# Altium project Mppt_Project.PrjPCB
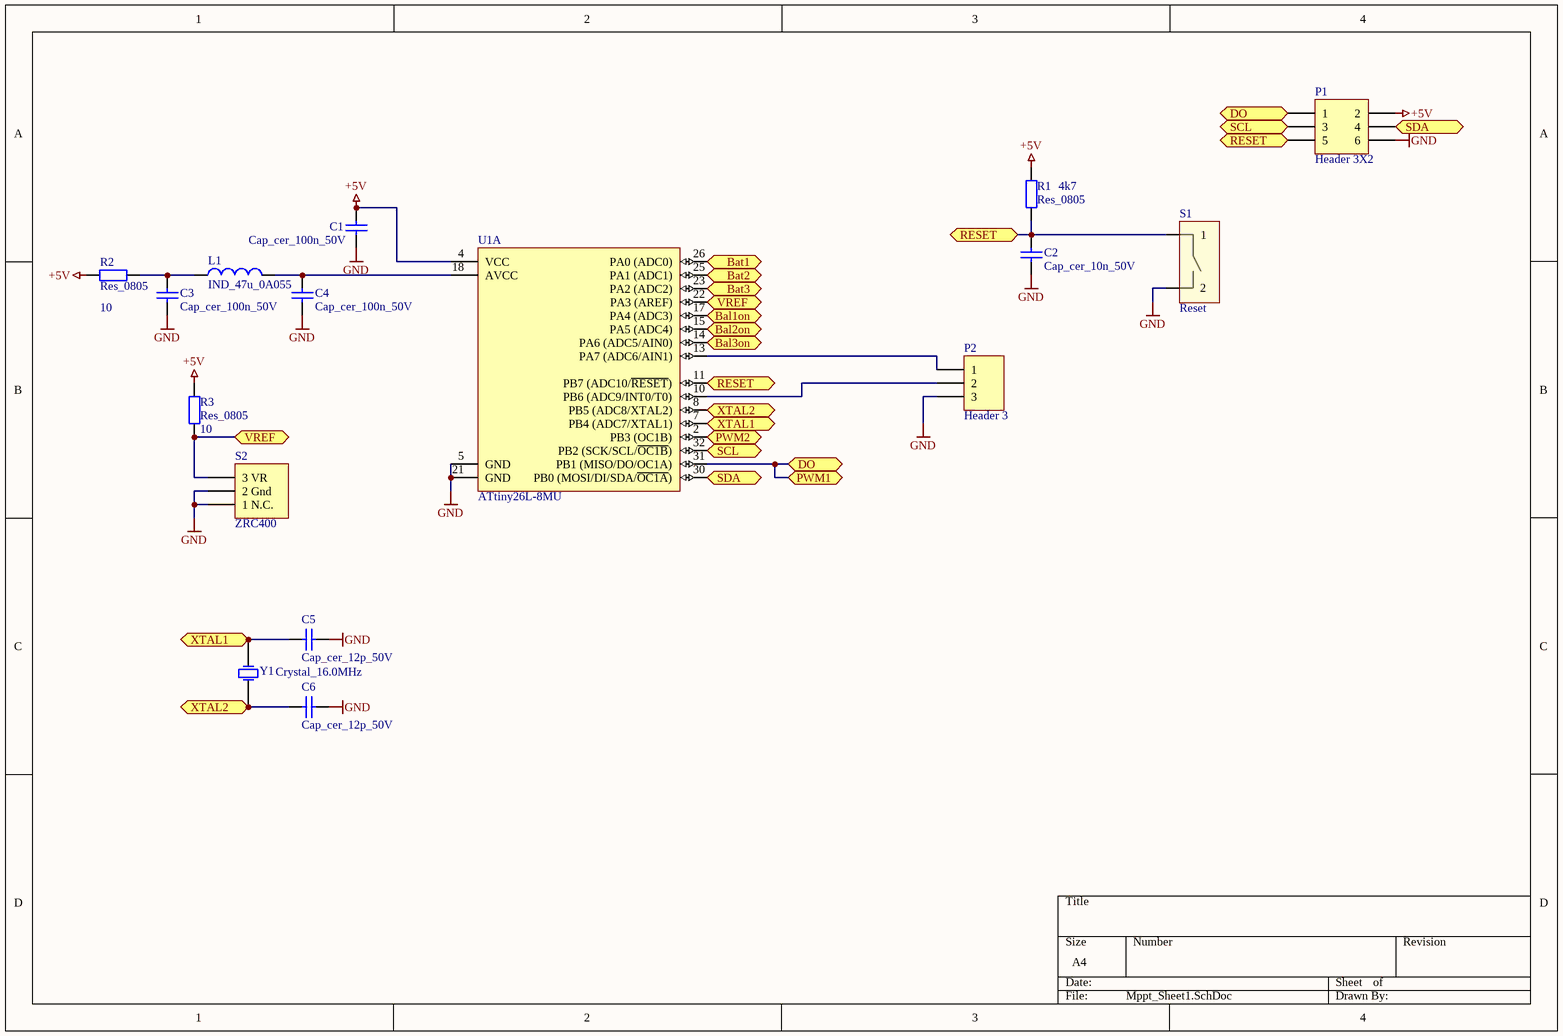
[diagram p0: Mppt_Sheet1.SchDoc]
5 sheets, 89 parts. Net scope: flat (ports and power ports of the same name join across sheets).
Board files: Mppt_PCB1.PcbDoc, Mppt_PCB2.PcbDoc, Mppt_PCB_seb.PcbDoc
Sheets:
  Mppt_Sheet1.SchDoc
  Boost.SchDoc
  Buck.SchDoc
  CurrentSensor.SchDoc
  Balancer.SchDoc

## Sheet Mppt_Sheet1.SchDoc
size A4

### Parts
C1  Cap_cer_100n_50V  [_0805]
C2  Cap_cer_10n_50V  [_0805]
C3  Cap_cer_100n_50V  [_0805]
C4  Cap_cer_100n_50V  [_0805]
C5  Cap_cer_12p_50V  [_0805]
C6  Cap_cer_12p_50V  [_0805]
L1  IND_47u_0A055  [COIL_0805]
P1  Header 3X2  [HDR2X3]
P2  Header 3  [HDR1X3]
R1  Res_0805  value 4k7  [_0805]
R2  Res_0805  value 10  [_0805]
R3  Res_0805  value 10  [_0805]
S1  Reset  [SWITCH_SMD]
S2  ZRC400  [SOT23_N]
U1  ATtiny26L-8MU  [32M1-A_N]  (part A of 2)
Y1  Crystal_16.0MHz  [XTAL_SMD]

### Ports
Bal1on, Bal2on, Bal3on, Bat1, Bat2, Bat3, DO, PWM1, PWM2, RESET, SCL, SDA, VREF, XTAL1, XTAL2

### Nets
+5V: C1.2 P1.2 R1.1 R2.1 R3.2 U1.4(VCC)
GND: C1.1 C2.2 C3.1 C4.1 C5.2 C6.2 P1.6 P2.3 S1.2 S2.1(1_N.C.) S2.2(2_Gnd) U1.5(GND) U1.21(GND)
NetC2_1: C2.1 P1.5 R1.2 S1.1 U1.11(PB7_(ADC10/~{RESET})) ; port RESET
NetC3_2: C3.2 L1.1 R2.2
NetC4_2: C4.2 L1.2 U1.18(AVCC)
NetC5_1: C5.1 U1.7(PB4_(ADC7/XTAL1)) Y1.2(OSC2) ; port XTAL1
NetC6_1: C6.1 U1.8(PB5_(ADC8/XTAL2)) Y1.1(OSC1) ; port XTAL2
NetP1_1: P1.1 U1.31(PB1_(MISO/DO/OC1A)) ; port DO, port PWM1
NetP1_3: P1.3 U1.32(PB2_(SCK/SCL/~{OC1B})) ; port SCL
NetP1_4: P1.4 U1.30(PB0_(MOSI/DI/SDA/~{OC1A})) ; port SDA
NetP2_1: P2.1 U1.13(PA7_(ADC6/AIN1))
NetP2_2: P2.2 U1.10(PB6_(ADC9/INT0/T0))
NetQ43_1: U1.14(PA6_(ADC5/AIN0)) ; port Bal3on
NetR3_1: R3.1 S2.3(3_VR) U1.22(PA3_(AREF)) ; port VREF
NetR44_1: U1.26(PA0_(ADC0)) ; port Bat1
NetR51_1: U1.25(PA1_(ADC1)) ; port Bat2
NetR58_1: U1.23(PA2_(ADC2)) ; port Bat3
NetU1_2: U1.2(PB3_(OC1B)) ; port PWM2
NetU1_15: U1.15(PA5_(ADC4)) ; port Bal2on
NetU1_17: U1.17(PA4_(ADC3)) ; port Bal1on

### Library data of the parts
C1 C3 C4 = Cap_124: QR: 0; Capacity: 100n; Voltage: 50V; UID: Cap_124; Name: Cap_cer_100n_50V; ComponentLink1URL: #NAME?; mounting: SMD
C2 = Cap_120: QR: 0; Capacity: 10n; Voltage: 50V; UID: Cap_120; Name: Cap_cer_10n_50V; ComponentLink1URL: #NAME?; mounting: SMD
C5 C6 = Cap_109: RS_number: 723-6206; QR: 0; Capacity: 12p; Voltage: 50V; UID: Cap_109; Name: Cap_cer_12p_50V; Name_Hyperlink: Keramikkondensator SMT 12 pF 50 VDC; ComponentLink1URL: #NAME?; mounting: SMD
L1 = Ind_41: Inductor; RS_number: 469-2883; QR: 0; Inductivity: 47 uH; Current: 0A055; UID: Ind_41; Name: IND_47u_0A055; Name_Hyperlink: http://at.rs-online.com/web/p/drahtgewickelte-smd-induktivitaten/4692883/?searchTerm=4692883&relevancy-data=636F3D3126696E3D4931384E525353746F636B4E756D6265724D504E266C753D656E266D6D3D6D61746368616C6C26706D3D5E5C647B367D247C5E5C647B377D247C5E5C647B31307D2; ComponentLink1URL: #NAME?; mounting: SMD
P1 = Con_41: QR: 0; UID: Con_41; Name: Header 3X2; mounting: THT; Pins: 2X3
P2 = Con_32: QR: 0; UID: Con_32; Name: Header 3; mounting: THT; Pins: 1X3
R1-R3 = Res_6: UID: Res_6; Name: Res_0805; ComponentLink1URL: #NAME?; mounting: SMD
S1 = Misc_11: QR: 0; UID: Misc_11; Name: Reset; ComponentLink1URL: #NAME?; mounting: SMD
S2 = Misc_1: 4,096V Voltage Regulator; QR: 0; UID: ZRC400; Name: ZRC400; ComponentLink1URL: http://at.rs-online.com/web/p/referenzspannungs-ics/7385115/; mounting: THT
U1 = ATtiny26L-8MU: 8-bit AVR Microcontroller, 2.7-5.5V, 8MHz, 2KB Flash, 128 Bytes EEPROM, 128 Bytes SRAM, 32-pin MLF, Industrial Grade (-40°C to 85°C), Pb-Free; DatasheetVersion: revK, Aug-2010; PackageVersion: revE, May-2006; PackageReference: 32M1-A; PackageDescription: 32-Pin Micro Lead Frame Package (MLF),  5 x 5 x 1.0 mm Body, Pitch 0.50 mm, 3.10mm Exposed Pad; Code_JEDEC: MO-220-VHHD-2; ComponentLink1Description: Manufacturer URL; ComponentLink1URL: http://www.atmel.com/; ComponentLink2Description: ATtiny26(L) Datasheet; ComponentLink2URL: http://www.atmel.com/dyn/resources/prod_documents/doc1477.pdf; ComponentLink3Description: ATtiny26(L) Summary; ComponentLink3URL: http://www.atmel.com/dyn/resources/prod_documents/1477S.pdf
Y1 = Crystal_19: RS_number: 703-1957; QR: 1; UID: Crystal_19; Name: Crystal_16.0MHz; Frequency: 16.0 MHz; Name_Hyperlink: Crystal, ABM7, 16.000MHz, SMD; ComponentLink1URL: #NAME?; mounting: SMD

## Sheet Boost.SchDoc
size A4
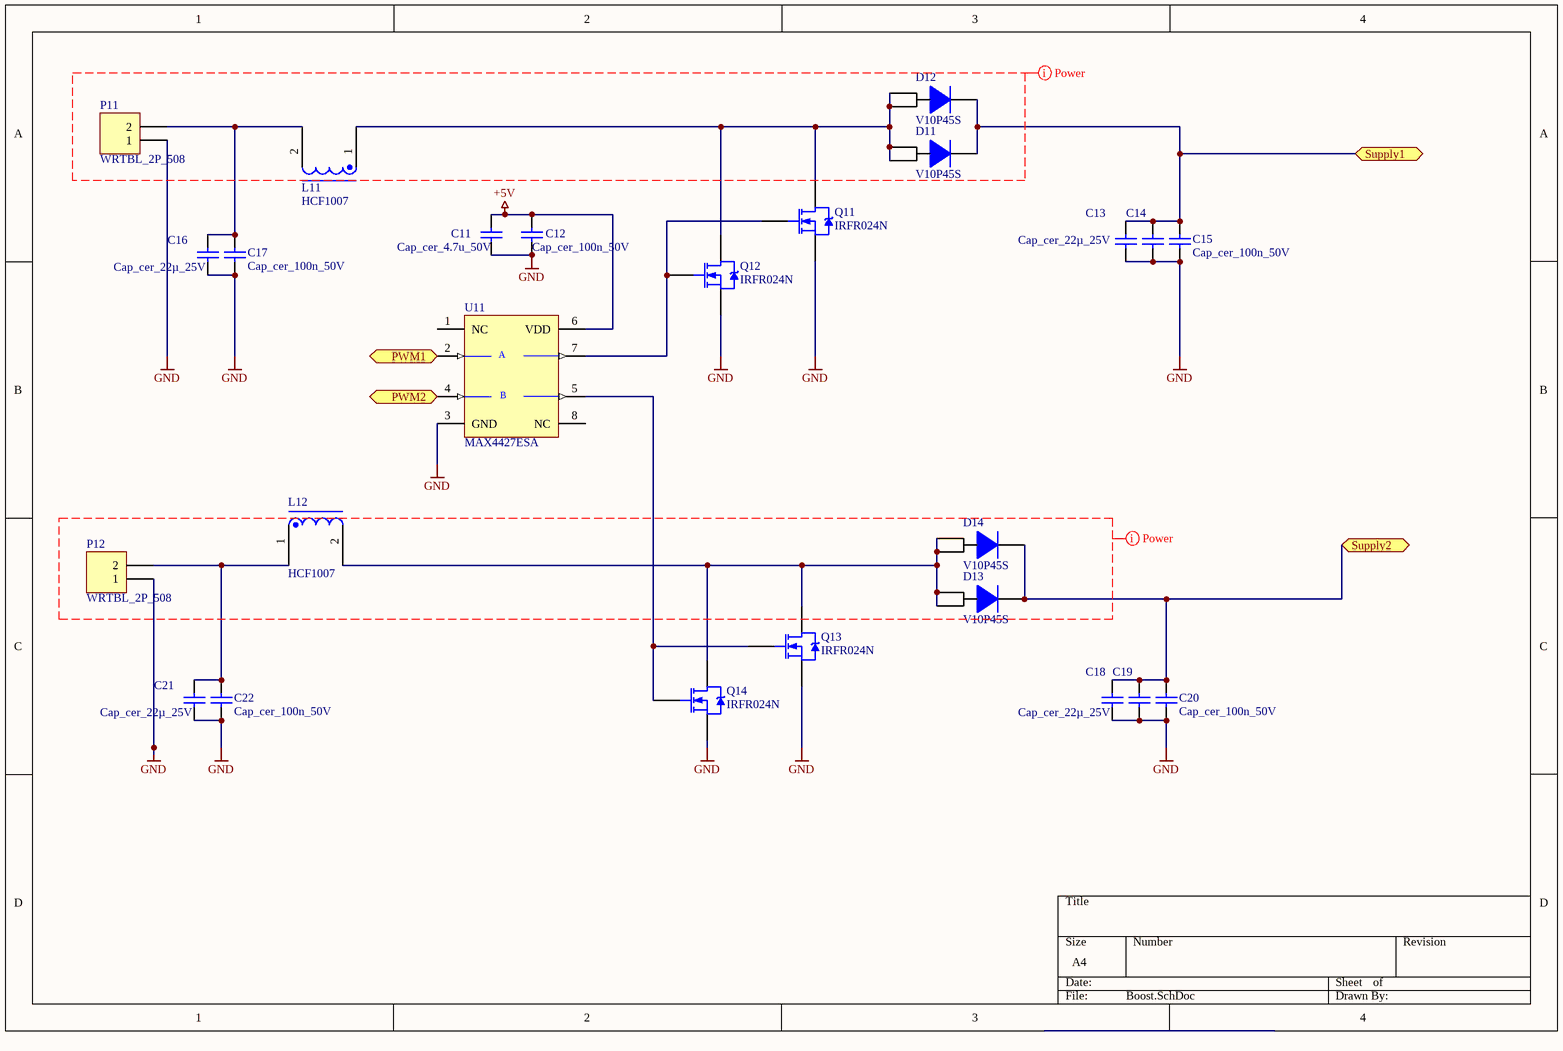
[diagram p1: Boost.SchDoc]

### Parts
C11  Cap_cer_4.7u_50V  [_0805]
C12  Cap_cer_100n_50V  [_0805]
C13  (no value)  [_0805]
C14  Cap_cer_22µ_25V  [_0805]
C15  Cap_cer_100n_50V  [_0805]
C16  Cap_cer_22µ_25V  [_0805]
C17  Cap_cer_100n_50V  [_0805]
C18  Cap_cer_22µ_25V  [_0805]  (value not drawn)
C19  Cap_cer_22µ_25V  [_0805]
C20  Cap_cer_100n_50V  [_0805]
C21  Cap_cer_22µ_25V  [_0805]
C22  Cap_cer_100n_50V  [_0805]
D11  V10P45S  [TO-277A]
D12  V10P45S  [TO-277A]
D13  V10P45S  [TO-277A]
D14  V10P45S  [TO-277A]
L11  HCF1007  [HCF1007]
L12  HCF1007  [HCF1007]
P11  WRTBL_2P_508  [WRTBL_2P_508]
P12  WRTBL_2P_508  [WRTBL_2P_508]
Q11  IRFR024N  [TO-252AA_N]
Q12  IRFR024N  [TO-252AA_N]
Q13  IRFR024N  [TO-252AA_N]
Q14  IRFR024N  [TO-252AA_N]
U11  MAX4427ESA  [NSO8_N]

### Ports
PWM1, PWM2, Supply1, Supply2

### Nets
+5V: C11.2 C12.2 U11.6(VDD)
GND: C11.1 C12.1 C13.1 C14.1 C15.1 C16.1 C17.1 C18.1 C19.1 C20.1 C21.1 C22.1 P11.1 P12.1 Q11.3(S) Q12.3(S) Q13.3(S) Q14.3(S) U11.3(GND)
NetC13_2: C13.2 C14.2 C15.2 D11.K D12.K ; port Supply1
NetC16_2: C16.2 C17.2 L11.2 P11.2
NetC18_2: C18.2 C19.2 C20.2 D13.K D14.K ; port Supply2
NetC21_2: C21.2 C22.2 L12.1 P12.2
NetD11_A1: D11.A1 D11.A2 D12.A1 D12.A2 L11.1 Q11.4(D) Q12.4(D)
NetD13_A1: D13.A1 D13.A2 D14.A1 D14.A2 L12.2 Q13.4(D) Q14.4(D)
NetP1_1: U11.2(INA) ; port PWM1
NetQ11_1: Q11.1(G) Q12.1(G) U11.7(OUTA)
NetQ13_1: Q13.1(G) Q14.1(G) U11.5(OUTB)
NetU1_2: U11.4(INB) ; port PWM2

Not connected (* = marked no-connect by the designer): U11 1(NC) 8(NC)

### Layout directives
net class Power: (no net found under the mark)

### Notes on the sheet
- (in symbol MAX4427ESA) A; B

### Library data of the parts
C11 C12 = Cap_124: QR: 0; Capacity: 4.7u; Voltage: 50V; UID: Cap_124; ComponentLink1URL: #NAME?; mounting: SMD
  C11: Name: Cap_cer_4.7u_50V
  C12: Name: Cap_cer_100n_50V
C13 = Cap_124: Name: Cap_cer_22µ_25V; QR: 0; Capacity: 22µ; Voltage: 25V; UID: Cap_124; ComponentLink1URL: http://at.rs-online.com/web/p/keramik-multilayer-kondensatoren/7900682/; mounting: SMD
C14 C16 C18 C19 C21 = Cap_124: QR: 0; Capacity: 22µ; Voltage: 25V; UID: Cap_124; Name: Cap_cer_22µ_25V; ComponentLink1URL: http://at.rs-online.com/web/p/keramik-multilayer-kondensatoren/7900682/; mounting: SMD
C15 C17 C20 C22 = Cap_124: QR: 0; Capacity: 100n; Voltage: 50V; UID: Cap_124; Name: Cap_cer_100n_50V; ComponentLink1URL: #NAME?; mounting: SMD
D11-D14 = V10P45S: V01P45 Shottky Diode; pin to pad: A1>1 A2>2
L11 L12 = HCF1007: HCF1007 Inductor
P11 P12 = Con_7: RS_number: 193-0586; QR: 0; UID: Con_7; Name: WRTBL_2P_508; Name_Hyperlink: Printklemme 5,08mm 2-polig; ComponentLink1URL: #NAME?; mounting: THT; Pins: 2
Q11-Q14 = IRFR024N: HEXFET N-Channel Power MOSFET; Note: Pin 2 is trimmed and is electrically connected to Drain.; Published: 8-Jun-2000; LatestRevisionDate: 20-Nov-2009; LatestRevisionNote: IPC-7351 Footprint Added.; DatasheetVersion: Apr-1998; PackageVersion: Feb-2003; PackageReference: TO-252AA; Publisher: Altium Limited; PackageDescription: 3-Pin HEXFET Package 2.28 mm Pitch, 9.9 mm Lead Span; Code_JEDEC: TO-252-AA; ComponentLink1Description: Manufacturer Link; ComponentLink1URL: http://www.irf.com/
U11 = MAX4427ESA: Dual High-Speed 1.5A MOSFET Driver; Published: 16-Jan-2001; LatestRevisionDate: 13-Apr-2006; LatestRevisionNote: IPC-7351 Footprint Added.; DatasheetVersion: Mar-1993; PackageReference: NSO8; Publisher: Altium Limited; PackageDescription: 8-Pin Small Outline Integrated Circuit 1.27 mm Pitch; Code_JEDEC: MS-012-AA; Code_IPC: SOIC127P600-8; ComponentLink1Description: Manufacturer Link; ComponentLink1URL: http://www.maxim-ic.com/; ComponentLink2Description: Datasheet; ComponentLink2URL: http://pdfserv.maxim-ic.com/en/ds/MAX4426-MAX4428.pdf

## Sheet Buck.SchDoc
size A4
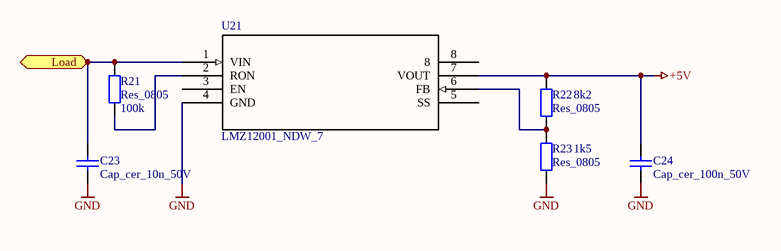
[diagram p2: Buck.SchDoc]

### Parts
C23  Cap_cer_10n_50V  [_0805]
C24  Cap_cer_100n_50V  [_0805]
R21  Res_0805  value 100k  [_0805]
R22  Res_0805  value 8k2  [_0805]
R23  Res_0805  value 1k5  [_0805]
U21  LMZ12001_NDW_7  [TZA07A]

### Ports
Load

### Nets
+5V: C24.2 R22.1 U21.7(VOUT)
GND: C23.2 C24.1 R23.2 U21.4(GND)
NetC23_1: C23.1 R21.2 U21.1(VIN) ; port Load
NetR21_1: R21.1 U21.2(RON)
NetR22_2: R22.2 R23.1 U21.6(FB)

Not connected (* = marked no-connect by the designer): U21 3(EN) 5(SS) 8

### Library data of the parts
C23 = Cap_120: QR: 0; Capacity: 10n; Voltage: 50V; UID: Cap_120; Name: Cap_cer_10n_50V; ComponentLink1URL: #NAME?; mounting: SMD
C24 = Cap_124: QR: 0; Capacity: 100n; Voltage: 50V; UID: Cap_124; Name: Cap_cer_100n_50V; ComponentLink1URL: #NAME?; mounting: SMD
R21-R23 = Res_6: UID: Res_6; Name: Res_0805; ComponentLink1URL: #NAME?; mounting: SMD
U21 = LMZ12001_NDW_7: Imported; Manufacturer: Texas Instruments; DatasheetURL: http://www.ti.com/lit/ds/symlink/lmz12001.pdf; basePN: LMZ12001; NSC_PackageReference: TZA07A; Manufacturer_Part_Number: lmz12001_ndw_7; Vendor: Texas Instruments; RefDes: RefDes; Type: DEV; Value: Value

## Sheet CurrentSensor.SchDoc
size A4
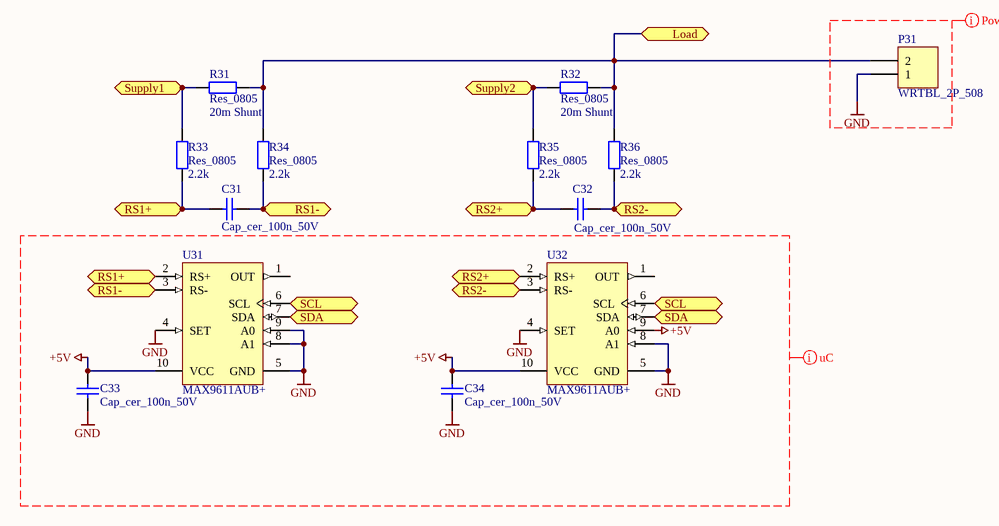
[diagram p3: CurrentSensor.SchDoc]

### Parts
C31  Cap_cer_100n_50V  [_0805]
C32  Cap_cer_100n_50V  [_0805]
C33  Cap_cer_100n_50V  [_0805]
C34  Cap_cer_100n_50V  [_0805]
P31  WRTBL_2P_508  [WRTBL_2P_508]
R31  Res_0805  value 20m Shunt  [_0805]
R32  Res_0805  value 20m Shunt  [_0805]
R33  Res_0805  value 2.2k  [_0805]
R34  Res_0805  value 2.2k  [_0805]
R35  Res_0805  value 2.2k  [_0805]
R36  Res_0805  value 2.2k  [_0805]
U31  MAX9611AUB+  [MAXM-U10+2_N]
U32  MAX9611AUB+  [MAXM-U10+2_N]

### Ports
Load, RS1+, RS1-, RS2+, RS2-, SCL, SDA, Supply1, Supply2

### Nets
+5V: C33.1 C34.2 U31.10(VCC) U32.9(A0) U32.10(VCC)
GND: C33.2 C34.1 P31.1 U31.4(SET) U31.5(GND) U31.8(A1) U31.9(A0) U32.4(SET) U32.5(GND) U32.8(A1)
NetC13_2: R31.1 R33.2 ; port Supply1
NetC18_2: R32.1 R35.2 ; port Supply2
NetC23_1: P31.2 R31.2 R32.2 R34.2 R36.2 ; port Load
NetC31_1: C31.1 R33.1 U31.2(RS+) ; port RS1+
NetC31_2: C31.2 R34.1 U31.3(RS-) ; port RS1-
NetC32_1: C32.1 R35.1 U32.2(RS+) ; port RS2+
NetC32_2: C32.2 R36.1 U32.3(RS-) ; port RS2-
NetP1_3: U31.6(SCL) U32.6(SCL) ; port SCL
NetP1_4: U31.7(SDA) U32.7(SDA) ; port SDA

Not connected (* = marked no-connect by the designer): U31 1(OUT); U32 1(OUT)

### Layout directives
net class Power: GND
net class uC: +5V, GND

### Library data of the parts
C31 C32 = Cap_120: QR: 0; Capacity: 100n; Voltage: 50V; UID: Cap_120; Name: Cap_cer_100n_50V; ComponentLink1URL: #NAME?; mounting: SMD
C33 C34 = Cap_124: QR: 0; Capacity: 100n; Voltage: 50V; UID: Cap_124; Name: Cap_cer_100n_50V; ComponentLink1URL: #NAME?; mounting: SMD
P31 = Con_7: RS_number: 193-0586; QR: 0; UID: Con_7; Name: WRTBL_2P_508; Name_Hyperlink: Printklemme 5,08mm 2-polig; ComponentLink1URL: #NAME?; mounting: THT; Pins: 2
R31-R36 = Res_6: UID: Res_6; Name: Res_0805; ComponentLink1URL: #NAME?; mounting: SMD
U31 U32 = MAX9611AUB+: High-side Current-Sense Amplifier with 12-bit I2C ADC and Op Amp / Comparator - Non-inverting, Adjustable Gain, -40 to 125 degC, 10-Pin SOP (U10+2), Pb-Free; Bi-Dir. Curr. Sense: No; Gain: Adj.; DatasheetVersion: Rev. 3; PackageVersion: Rev. L, 07/2008; PackageReference: U10+2; PackageDescription: 10-Pin Micro-MAX, Thin Shrink Small-Outline (U10+2), Body 3 x 3 mm, Pitch 0.5 mm; Supplier 1: Digi-Key; Supplier Part Number 1: MAX9611AUB+-ND; Supplier 2: Farnell; Supplier Part Number 2: 2212297; Supplier 3: Newark; Supplier Part Number 3: 45W6334; Supplier 4: Mouser; Supplier Part Number 4: 700-MAX9611AUB+; Mounting Technology: Surface Mount; Code_JEDEC: MO-187; PartNumber: MAX9611AUB+; ComponentLink1Description: Manufacturer URL; ComponentLink1URL: http://www.maximintegrated.com/; ComponentLink2Description: Datasheet; ComponentLink2URL: http://datasheets.maximintegrated.com/en/ds/MAX9611-MAX9612.pdf; ComponentLink3Description: Package Specification; ComponentLink3URL: http://pdfserv.maximintegrated.com/package_dwgs/21-0061.PDF

## Sheet Balancer.SchDoc
size A4
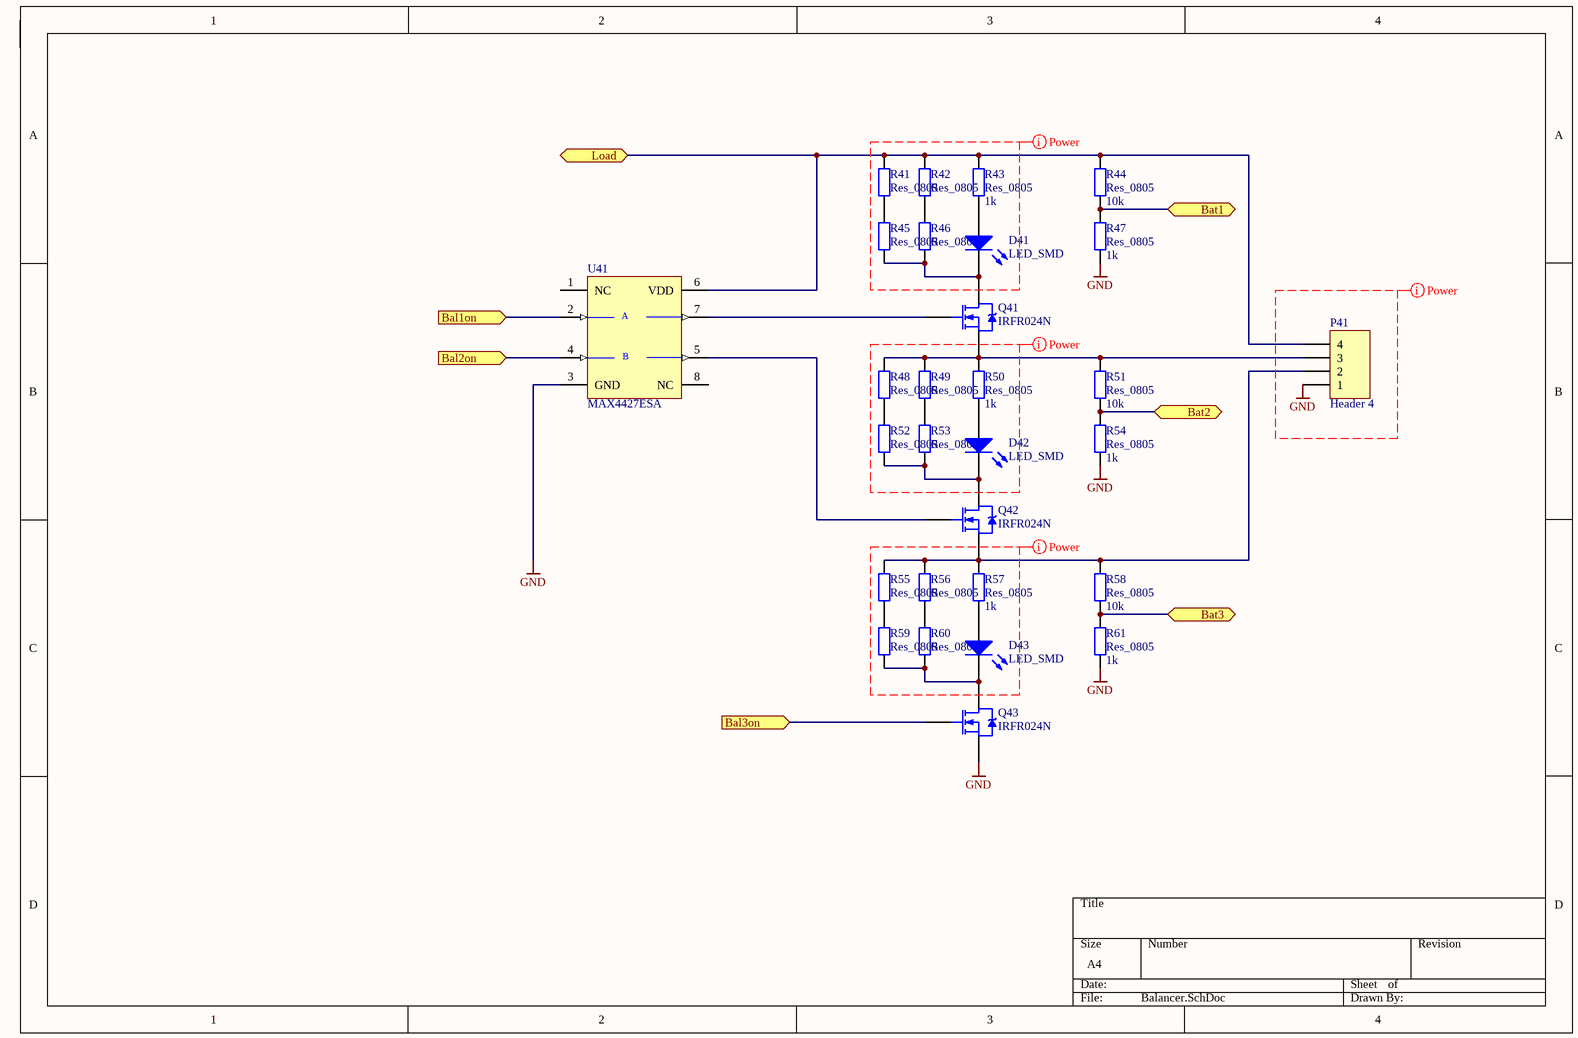
[diagram p4: Balancer.SchDoc]

### Parts
D41  LED_SMD  [LED_SMD]
D42  LED_SMD  [LED_SMD]
D43  LED_SMD  [LED_SMD]
P41  Header 4  [HDR1X4]
Q41  IRFR024N  [TO-252AA_N]
Q42  IRFR024N  [TO-252AA_N]
Q43  IRFR024N  [TO-252AA_N]
R41  Res_0805  [_0805]
R42  Res_0805  [_0805]
R43  Res_0805  value 1k  [_0805]
R44  Res_0805  value 10k  [_0805]
R45  Res_0805  [_0805]
R46  Res_0805  [_0805]
R47  Res_0805  value 1k  [_0805]
R48  Res_0805  [_0805]
R49  Res_0805  [_0805]
R50  Res_0805  value 1k  [_0805]
R51  Res_0805  value 10k  [_0805]
R52  Res_0805  [_0805]
R53  Res_0805  [_0805]
R54  Res_0805  value 1k  [_0805]
R55  Res_0805  [_0805]
R56  Res_0805  [_0805]
R57  Res_0805  value 1k  [_0805]
R58  Res_0805  value 10k  [_0805]
R59  Res_0805  [_0805]
R60  Res_0805  [_0805]
R61  Res_0805  value 1k  [_0805]
U41  MAX4427ESA  [NSO8_N]

### Ports
Bal1on (in), Bal2on (in), Bal3on (in), Bat1, Bat2, Bat3, Load

### Nets
GND: P41.1 Q43.3(S) R47.1 R54.1 R61.1 U41.3(GND)
NetC23_1: P41.4 R41.2 R42.2 R43.2 R44.2 U41.6(VDD) ; port Load
NetD41_1: D41.1 R43.1
NetD41_2: D41.2 Q41.4(D) R45.1 R46.1
NetD42_1: D42.1 R50.1
NetD42_2: D42.2 Q42.4(D) R52.1 R53.1
NetD43_1: D43.1 R57.1
NetD43_2: D43.2 Q43.4(D) R59.1 R60.1
NetP41_2: P41.2 Q42.3(S) R55.2 R56.2 R57.2 R58.2
NetP41_3: P41.3 Q41.3(S) R48.2 R49.2 R50.2 R51.2
NetQ41_1: Q41.1(G) U41.7(OUTA)
NetQ42_1: Q42.1(G) U41.5(OUTB)
NetQ43_1: Q43.1(G) ; port Bal3on
NetR41_1: R41.1 R45.2
NetR42_1: R42.1 R46.2
NetR44_1: R44.1 R47.2 ; port Bat1
NetR48_1: R48.1 R52.2
NetR49_1: R49.1 R53.2
NetR51_1: R51.1 R54.2 ; port Bat2
NetR55_1: R55.1 R59.2
NetR56_1: R56.1 R60.2
NetR58_1: R58.1 R61.2 ; port Bat3
NetU1_15: U41.4(INB) ; port Bal2on
NetU1_17: U41.2(INA) ; port Bal1on

Not connected (* = marked no-connect by the designer): U41 1(NC) 8(NC)

### Layout directives
net class Power: (no net found under the mark), GND

### Notes on the sheet
- (in symbol MAX4427ESA) A; B

### Library data of the parts
D41-D43 = DIODE_48: Type: LED; QR: 0; UID: DIODE_48; Name: LED_SMD; ComponentLink1URL: #NAME?; mounting: SMD
P41 = Con_33: QR: 0; UID: Con_33; Name: Header 4; mounting: THT; Pins: 1X4
Q41-Q43 = IRFR024N: as Q11 on sheet Boost; Published: 8-Jun-2000; LatestRevisionDate: 20-Nov-2009; LatestRevisionNote: IPC-7351 Footprint Added.; DatasheetVersion: Apr-1998; PackageVersion: Feb-2003; PackageReference: TO-252AA; Publisher: Altium Limited; PackageDescription: 3-Pin HEXFET Package 2.28 mm Pitch, 9.9 mm Lead Span; Code_JEDEC: TO-252-AA; ComponentLink1Description: Manufacturer Link; ComponentLink1URL: http://www.irf.com/
R41-R61 = Res_6: UID: Res_6; Name: Res_0805; ComponentLink1URL: #NAME?; mounting: SMD
U41 = MAX4427ESA: Dual High-Speed 1.5A MOSFET Driver; Published: 16-Jan-2001; LatestRevisionDate: 13-Apr-2006; LatestRevisionNote: IPC-7351 Footprint Added.; DatasheetVersion: Mar-1993; PackageReference: NSO8; Publisher: Altium Limited; PackageDescription: 8-Pin Small Outline Integrated Circuit 1.27 mm Pitch; Code_JEDEC: MS-012-AA; Code_IPC: SOIC127P600-8; ComponentLink1Description: Manufacturer Link; ComponentLink1URL: http://www.maxim-ic.com/; ComponentLink2Description: Datasheet; ComponentLink2URL: http://pdfserv.maxim-ic.com/en/ds/MAX4426-MAX4428.pdf

## Nets that join several sheets
+5V: Mppt_Sheet1 (6 pins), Boost (C11.2 C12.2 U11.6), Buck (C24.2 R22.1 U21.7), CurrentSensor (5 pins)
GND: Mppt_Sheet1 (13 pins), Boost (19 pins), Buck (C23.2 C24.1 R23.2 U21.4), CurrentSensor (10 pins), Balancer (6 pins)
NetC13_2: Boost (5 pins), CurrentSensor (R31.1 R33.2)
NetC18_2: Boost (5 pins), CurrentSensor (R32.1 R35.2)
NetC23_1: Buck (C23.1 R21.2 U21.1), CurrentSensor (5 pins), Balancer (6 pins)
NetP1_1: Mppt_Sheet1 (P1.1 U1.31), Boost (U11.2)
NetP1_3: Mppt_Sheet1 (P1.3 U1.32), CurrentSensor (U31.6 U32.6)
NetP1_4: Mppt_Sheet1 (P1.4 U1.30), CurrentSensor (U31.7 U32.7)
NetQ43_1: Mppt_Sheet1 (U1.14), Balancer (Q43.1)
NetR44_1: Mppt_Sheet1 (U1.26), Balancer (R44.1 R47.2)
NetR51_1: Mppt_Sheet1 (U1.25), Balancer (R51.1 R54.2)
NetR58_1: Mppt_Sheet1 (U1.23), Balancer (R58.1 R61.2)
NetU1_2: Mppt_Sheet1 (U1.2), Boost (U11.4)
NetU1_15: Mppt_Sheet1 (U1.15), Balancer (U41.4)
NetU1_17: Mppt_Sheet1 (U1.17), Balancer (U41.2)